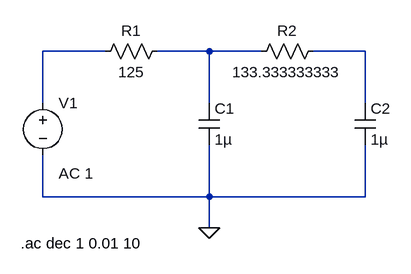
[diagram p0: schematic Project1Draft1.asc]
Project1Draft1.asc, the LTspice schematic file:
Version 4
SHEET 1 880 680
WIRE 144 48 48 48
WIRE 304 48 224 48
WIRE 384 48 304 48
WIRE 544 48 464 48
WIRE 48 128 48 48
WIRE 304 128 304 48
WIRE 544 128 544 48
WIRE 48 272 48 208
WIRE 304 272 304 192
WIRE 304 272 48 272
WIRE 544 272 544 192
WIRE 544 272 304 272
WIRE 304 320 304 272
FLAG 304 320 0
SYMBOL res 240 32 R90
WINDOW 0 0 56 VBottom 2
WINDOW 3 32 56 VTop 2
SYMATTR InstName R1
SYMATTR Value 125
SYMBOL res 368 64 R270
WINDOW 0 32 56 VTop 2
WINDOW 3 0 56 VBottom 2
SYMATTR InstName R2
SYMATTR Value 133.333333333
SYMBOL cap 288 128 R0
SYMATTR InstName C1
SYMATTR Value 1µ
SYMBOL cap 528 128 R0
SYMATTR InstName C2
SYMATTR Value 1µ
SYMBOL voltage 48 112 R0
WINDOW 123 24 124 Left 2
WINDOW 39 0 0 Left 0
SYMATTR Value2 AC 1
SYMATTR InstName V1
SYMATTR Value ""
TEXT 14 344 Left 2 !.ac dec 1 0.01 10

The netlist it stands for:
* Project1Draft1.asc
R1 N002 N001 125
R2 N002 N003 133.333333333
C1 N002 0 1µ
C2 N003 0 1µ
V1 N001 0 AC 1
.ac dec 1 0.01 10
.backanno
.end